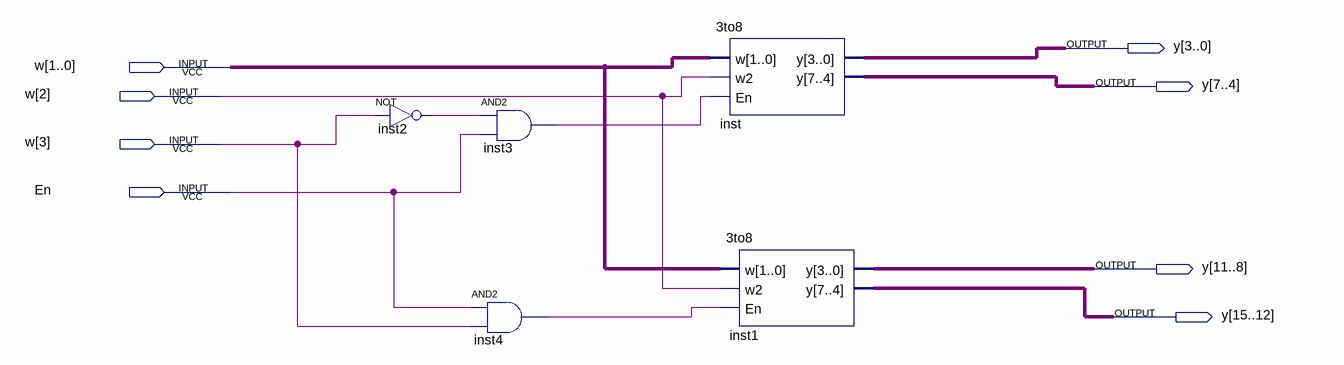
[diagram p0: schematic sheet]
// Quartus schematic 4to16decoderreal.bdf as structural Verilog: 5 symbols, 8 pins
module \4to16decoderreal  (
  input  [3:0] w,
  input  En,
  output [15:0] y
);

  wire inst2_out, inst3_out, inst4_out;

  not inst2 (inst2_out, w[3]);
  and inst3 (inst3_out, inst2_out, En);
  and inst4 (inst4_out, En, w[3]);
  \3to8  inst (.w(w[1:0]), .w2(w[2]), .En(inst3_out), .y(y[7:0]));
  \3to8  inst1 (.w(w[1:0]), .w2(w[2]), .En(inst4_out), .y(y[15:8]));
endmodule
